# Altium schematic sheet USB Isolation.SchDoc
size A
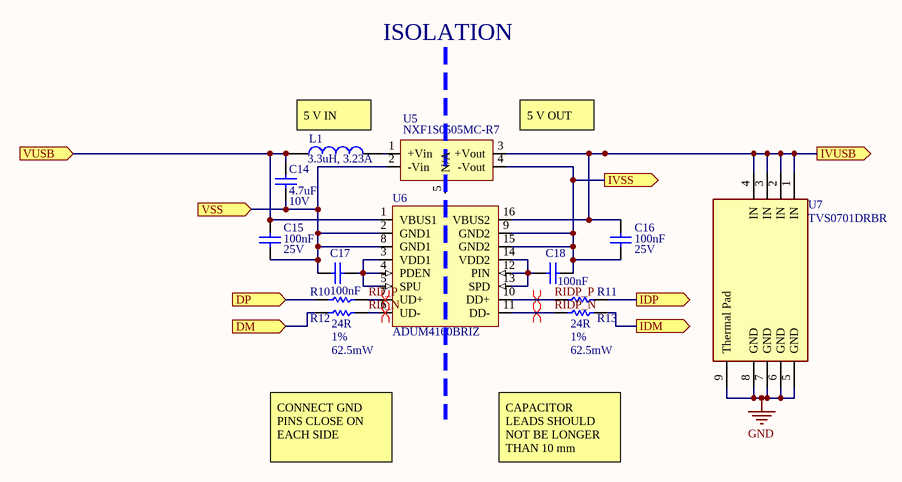
[diagram p0: USB Isolation.SchDoc]

## Parts
C14  value 4.7uF  Voltage Rating: 10V  [0603 CAPACITOR]  (hidden comment: LMK107BJ475KA-T)
C15  value 100nF  Voltage Rating: 25V  [0603 CAPACITOR]  (hidden comment: CGA3E2X7R1E104K080AA)
C16  value 100nF  Voltage Rating: 25V  [0603 CAPACITOR]  (hidden comment: CGA3E2X7R1E104K080AA)
C17  value 100nF  [0603 CAPACITOR]  (hidden comment: CGA3E2X7R1E104K080AA)
C18  value 100nF  [0603 CAPACITOR]  (hidden comment: CGA3E2X7R1E104K080AA)
L1  3.3uH, 3.23A  [WE-LQS_4025]
R10  MCMR04X24R0FTL  [0402 RESISTOR]  (value not drawn)
R11  MCMR04X24R0FTL  [0402 RESISTOR]  (value not drawn)
R12  Resistance: 24R  Tolerance: 1%  Power Rating: 62.5mW  [0402 RESISTOR]  (hidden comment: MCMR04X24R0FTL)
R13  Resistance: 24R  Tolerance: 1%  Power Rating: 62.5mW  [0402 RESISTOR]  (hidden comment: MCMR04X24R0FTL)
U5  NXF1S0505MC-R7  [QFN254P1524X1067X501-6N]
U6  ADUM4160BRIZ  [SOIC127P1030X265-16N]
U7  TVS0701DRBR  [FP-DRB0008A-MFG]

## Ports
DM (in), DP (in), IDM (out), IDP (out), IVSS (out), IVUSB (out), VSS (in), VUSB (in)

## Nets
GND: U7.5(GND) U7.6(GND) U7.7(GND) U7.8(GND) U7.9(Thermal_Pad)
DM: R12.1 ; port DM
DP: R10.1 ; port DP
IDM: R13.2 ; port IDM
IDP: R11.2 ; port IDP
IVSS: C16.1 C18.1 U5.4(-Vout) U6.9(GND2) U6.15(GND2) ; port IVSS
IVUSB: C16.2 U5.3(+Vout) U6.16(VBUS2) U7.1(IN) U7.2(IN) U7.3(IN) U7.4(IN) ; port IVUSB
RD_N: R12.2 U6.6(UD-)
RD_P: R10.2 U6.7(UD+)
RIDP_N: R13.1 U6.11(DD-)
RIDP_P: R11.1 U6.10(DD+)
VSS: C14.1 C15.1 C17.2 U5.2(-Vin) U6.2(GND1) U6.8(GND1) ; port VSS
VUSB: C14.2 C15.2 L1.1 U6.1(VBUS1) ; port VUSB
NetC17_1: C17.1 U6.3(VDD1) U6.4(PDEN) U6.5(SPU)
NetC18_2: C18.2 U6.12(PIN) U6.13(SPD) U6.14(VDD2)
NetL1_2: L1.2 U5.1(+Vin)

Not connected (* = marked no-connect by the designer): U5 5(N/A)

## Layout directives
differential pair; differential pair class USB: RD_N, RD_P, RIDP_N, RIDP_P

## Notes on the sheet
- ISOLATION
- 5 V IN
- (near U5) 5 V OUT
- CONNECT GND PINS CLOSE ON EACH SIDE
- CAPACITOR LEADS SHOULD NOT BE LONGER THAN 10 mm

## Library data of the parts
C14 = CMP-001-00085-5: Cap Ceramic 4.7uF 10V X5R 10% SMD 0603 85°C; Case Code (Imperial): 0603; Number of Pins: 2; Dielectric: X5R; Dielectric Material: Ceramic; Contact Plating: Nickel; REACH SVHC: Unknown; Package Quantity: 1; Width: 0.031inch; Lead Free: Lead Free; Min Operating Temperature: -55°C; Packaging: Tape and Reel; Height: 0.8mm; Case Code (Metric): 1608; Length: 1.6mm; Tolerance: 10%; Case/Package: 0603; Max Operating Temperature: 85°C; Radiation Hardening: No; Mount: Surface Mount; Voltage Rating (DC): 10V; Depth: 0.8mm; Halogen Free: Halogen Free; Termination: SMD/SMT; Thickness: 0.035inch
C15-C18 = CMP-001-00083-5: Cap Ceramic 0.1uF 25V X7R 10% SMD 0603 125°C; Max Operating Temperature: 125°C; Mount: Surface Mount; Thickness: 0.035inch; Composition: Ceramic; Lead Free: Lead Free; Case/Package: 0603; Packaging: Tape and Reel; Ratings: AEC-Q200; Min Operating Temperature: -55°C; Weight: 7.1E-05oz; Width: 0.031inch; Termination: SMD/SMT; Tolerance: 10%; Package Quantity: 1; REACH SVHC: No SVHC; Dielectric: X7R; Voltage Rating (DC): 25V; Case Code (Imperial): 0603; Height: 0.8mm; Case Code (Metric): 1608; Depth: 0.8mm; Length: 1.6mm
  C17 C18: Voltage Rating: 25V
L1 = 74404043033A: WE-LQS SMT Power Inductor, size 4025, 3.3uH, 3.23A; Manufacturer: Wurth Elektronik; Saturation Current: 1.75A; Self Resonant Frequency: 75MHz; DC Resistance: 33mOhm; ComponentLink1Description: Manufacturer; ComponentLink1URL: http://www.we-online.de; ComponentLink2Description: Datasheet; ComponentLink2URL: https://www.we-online.com/catalog/datasheet/74404043033A.pdf; Published Date: May 2020; Rated Current: 3.23A; Operating Temperature: -40 to +125degC; Mounting Technology: SMT; Packaging: Tape and Reel; Manufacturer Part Number: 74404043033A; Inductance: 3.3uH; Size: 4025
R10 R11 = CMP-009-00178-9: MULTICOMP - MCMR04X24R0FTL - RES, CERAMIC 24R, 1%, 0.063W, 0402; Power Rating: 62.5mW; Voltage Rating (DC): 50V; Temperature Coefficient: 100ppm/°C; Resistance: 24R; Tolerance: 1%; REACH SVHC: No SVHC; Case/Package: 0402; Packaging: Cut Tape; Voltage Rating: 50V; Case Code (Metric): 1005; Composition: Ceramic; Case Code (Imperial): 0402
R12 R13 = CMP-009-00178-9: MULTICOMP - MCMR04X24R0FTL - RES, CERAMIC 24R, 1%, 0.063W, 0402; Voltage Rating (DC): 50V; Temperature Coefficient: 100ppm/°C; REACH SVHC: No SVHC; Case/Package: 0402; Packaging: Cut Tape; Voltage Rating: 50V; Case Code (Metric): 1005; Composition: Ceramic; Case Code (Imperial): 0402
U5 = CMP-019-00050-4: Module Dc-dc 5 Vin 1-OUT 5V 0.2A 1W 5-PIN SMD T/r
U6 = CMP-019-00049-3: ANALOG DEVICES   ADUM4160BRIZ   Digital Isolator, 1, 60 ns, 3.1 V, 5.5 V, SOIC, 16 Pins; Isolated Power: No; Number of Channels: 2; Min Supply Voltage: 3.1V; Propagation Delay: 70ns; Max Supply Voltage: 5.5V; Rise Time: 20ns; Channel Type: Bidirectional; Nominal Supply Current: 6mA; Data Rate: 12Mbps; Max Input Current: 8mA; Turn-On Delay Time: 60ns; Depth: 2.65mm; Contact Plating: Tin,Matte; REACH SVHC: No SVHC; Min Operating Temperature: -40°C; Lead Free: Contains Lead; Number of Pins: 16; Packaging: Rail/Tube; Case/Package: SOIC; Length: 10.5mm; Package Quantity: 37; Max Operating Temperature: 105°C; Width: 7.6mm
U7 = CMP-04985-000001-1: TVS ARRAYS; Manufacturer: Texas instruments; Capacitance: 77pF; Peak Pulse Current: 30A; Standoff Height: 0mm; Direction: Bidirectional; Number Of Channels: 1; Breakdown Voltage: 9.3V; Reverse Standoff Voltage: 7V; Value: 77pF; Clamping Voltage: 11V; Temperature Range Low: -40°C; Category: IC; Lead Free: Yes; Device Class L2: ESD and Circuit Protection ICs; Ambient Temperature Range High: +125°C; RoHS: TRUE; Manufacturer Part Number: TVS0701DRBR; Device Class L3: unset; Ambient Temperature Range Low: -40°C; Mouser Description: 7-V bidirectional flat-clamp surge protection device 8-SON -40 to 125; Height: 1mm; Octopart: https://octopart.com/tvs0701drbr-texas+instruments-96189204; Automotive: No; Temperature: -40°C to +125°C; ComponentLink2URL: http://www.ti.com/lit/ds/symlink/tvs0701.pdf; Device Class L1: Circuit Protection; Package: DRB0008A; Digikey Description: TVS ARRAYS; Temperature Range High: +125°C; ComponentLink2Description: Datasheet